# Altium project brushless_no_sensor.PrjPCB
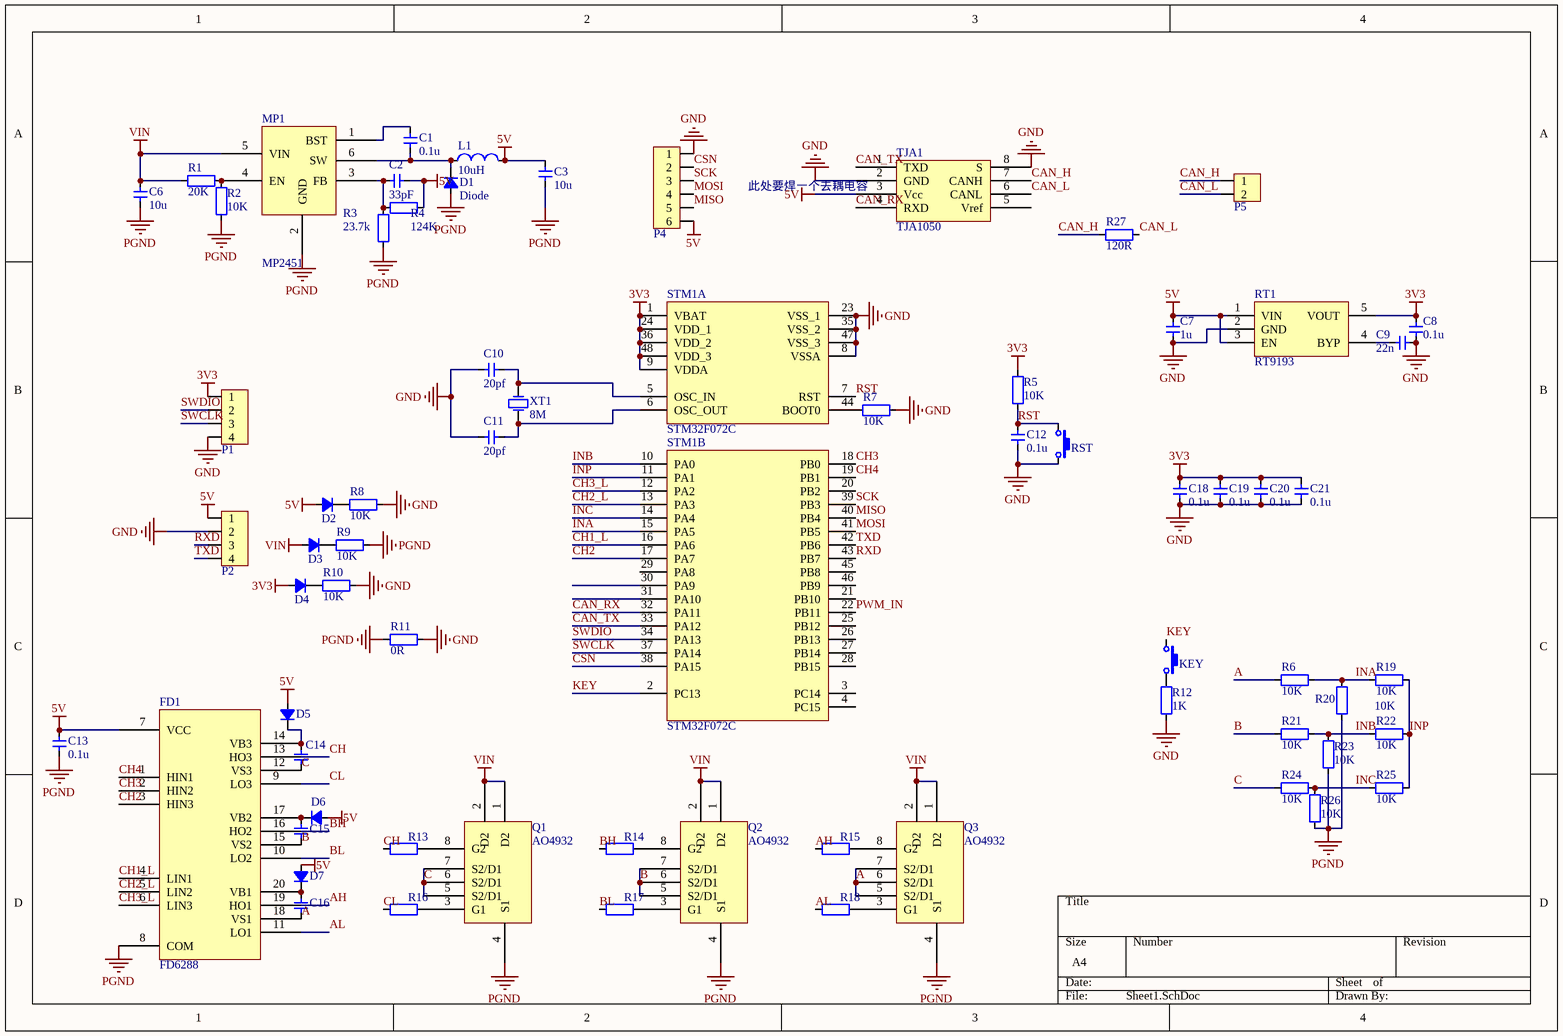
[diagram p0: Sheet1.SchDoc]
1 sheet, 68 parts. Net scope: global (net labels, ports and power ports of the same name join across sheets).
Board file: brushless_nosensor.PcbDoc

## Sheet Sheet1.SchDoc
size A4

### Parts
C1  value 0.1u  [CAP_0603]  (hidden comment: Cap_0603)
C2  value 33pF  [CAP_0603]  (hidden comment: Cap_0603)
C3  value 10u  [CAP_0805]  (hidden comment: Cap_0805)
C6  value 10u  [CAP_0805]  (hidden comment: Cap_0805)
C7  value 1u  [CAP_0603]  (hidden comment: Cap_0603)
C8  value 0.1u  [CAP_0603]  (hidden comment: Cap_0603)
C9  value 22n  [CAP_0603]  (hidden comment: Cap_0603)
C10  value 20pf  [CAP_0603]  (hidden comment: Cap_0603)
C11  value 20pf  [CAP_0603]  (hidden comment: Cap_0603)
C12  value 0.1u  [CAP_0603]  (hidden comment: Cap_0603)
C13  value 0.1u  [CAP_0603]  (hidden comment: Cap_0603)
C14  Cap_0603  [CAP_0603]  (value not drawn)
C15  Cap_0603  [CAP_0603]  (value not drawn)
C16  Cap_0603  [CAP_0603]  (value not drawn)
C18  value 0.1u  [CAP_0603]  (hidden comment: Cap_0603)
C19  value 0.1u  [CAP_0603]  (hidden comment: Cap_0603)
C20  value 0.1u  [CAP_0603]  (hidden comment: Cap_0603)
C21  value 0.1u  [CAP_0603]  (hidden comment: Cap_0603)
D1  Diode  [LED_0805_RED]
D2  D_0805  [LED_0805_YELLOW]  (value not drawn)
D3  D_0805  [LED_0805_YELLOW]  (value not drawn)
D4  D_0805  [LED_0805_YELLOW]  (value not drawn)
D5  D_0805  [LED_0805_YELLOW]  (value not drawn)
D6  D_0805  [LED_0805_YELLOW]  (value not drawn)
D7  D_0805  [LED_0805_YELLOW]  (value not drawn)
FD1  FD6288  [TSSOP_E170_P0.65_20]
KEY  ButtonTACT_3x4x2_180  [ButtonTACT_3x4x2_180H]  (value not drawn)
L1  value 10uH  [IND_CD52]  (hidden comment: Ind_CD32)
MP1  MP2451  [SOT23-6]
P1  HDR1x4_2.54  [HDR1x4_2.54_180]  (value not drawn)
P2  HDR1x4_2.54  [HDR1x4_2.54_180]  (value not drawn)
P4  HDR1x6_2.54  [1.25mm_1X6_SMT]  (value not drawn)
P5  HDR1x2_2.54  [HDR1X2_2.54_180]  (value not drawn)
Q1  AO4932  [SOP_E150_8]
Q2  AO4932  [SOP_E150_8]
Q3  AO4932  [SOP_E150_8]
R1  value 20K  [RES_0603]  (hidden comment: Res_0603)
R2  value 10K  [RES_0603]  (hidden comment: Res_0603)
R3  value 23.7k  [RES_0603]  (hidden comment: Res_0603)
R4  value 124K  [RES_0603]  (hidden comment: Res_0603)
R5  value 10K  [RES_0603]  (hidden comment: Res_0603)
R6  value 10K  [RES_0603]  (hidden comment: Res_0603)
R7  value 10K  [RES_0603]  (hidden comment: Res_0603)
R8  value 10K  [RES_0603]  (hidden comment: Res_0603)
R9  value 10K  [RES_0603]  (hidden comment: Res_0603)
R10  value 10K  [RES_0603]  (hidden comment: Res_0603)
R11  value 0R  [RES_0603]  (hidden comment: Res_0603)
R12  value 1K  [RES_0603]  (hidden comment: Res_0603)
R13  Res_0603  [RES_0603]  (value not drawn)
R14  Res_0603  [RES_0603]  (value not drawn)
R15  Res_0603  [RES_0603]  (value not drawn)
R16  Res_0603  [RES_0603]  (value not drawn)
R17  Res_0603  [RES_0603]  (value not drawn)
R18  Res_0603  [RES_0603]  (value not drawn)
R19  value 10K  [RES_0603]  (hidden comment: Res_0603)
R20  value 10K  [RES_0603]  (hidden comment: Res_0603)
R21  value 10K  [RES_0603]  (hidden comment: Res_0603)
R22  value 10K  [RES_0603]  (hidden comment: Res_0603)
R23  value 10K  [RES_0603]  (hidden comment: Res_0603)
R24  value 10K  [RES_0603]  (hidden comment: Res_0603)
R25  value 10K  [RES_0603]  (hidden comment: Res_0603)
R26  value 10K  [RES_0603]  (hidden comment: Res_0603)
R27  value 120R  [RES_0603]  (hidden comment: Res_0603)
RST  ButtonTACT_3x4x2_180  [ButtonTACT_3x4x2_180H]  (value not drawn)
RT1  RT9193  [SOT23-5]
STM1  STM32F072C  [LQFP_P0.5_48]  (parts A,B of 2)
TJA1  TJA1050  [SOP_E150_8]
XT1  value 8M  [XT_5032_2]  (hidden comment: XTAL_5032_2P)

### Nets
3V3: C8.2 C18.2 C19.2 C20.2 C21.2 D4.1(A) P1.1 R5.2 RT1.5(VOUT) STM1.1(VBAT) STM1.9(VDDA) STM1.24(VDD_1) STM1.36(VDD_2) STM1.48(VDD_3)
5V: C2.1 C3.2 C7.2 C13.2 D2.1(A) D5.1(A) D6.1(A) D7.1(A) FD1.7(VCC) L1.2 P2.1 P4.6 R4.2 RT1.1(VIN) RT1.3(EN) TJA1.3(Vcc)
GND: C7.1 C8.1 C9.1 C10.1 C11.1 C12.1 C18.1 C19.1 C20.1 C21.1 P1.4 P2.2 P4.1 R7.1 R8.2 R10.2 R11.2 R12.1 RST.2 RT1.2(GND) STM1.8(VSSA) STM1.23(VSS_1) STM1.35(VSS_2) STM1.47(VSS_3) TJA1.2(GND) TJA1.8(S)
PGND: C3.1 C6.1 C13.1 D1.1(A) FD1.8(COM) MP1.2(GND) Q1.4(S1) Q2.4(S1) Q3.4(S1) R2.2 R3.2 R9.2 R11.1 R20.1 R23.1 R26.1
VIN: C6.2 D3.1(A) MP1.5(VIN) Q1.1(D2) Q1.2(D2) Q2.1(D2) Q2.2(D2) Q3.1(D2) Q3.2(D2) R1.1
A: C16.2 FD1.18(VS1) Q3.5(S2/D1) Q3.6(S2/D1) Q3.7(S2/D1) R6.1
AH: FD1.19(HO1) R15.1
AL: FD1.11(LO1) R18.1
B: C15.2 FD1.15(VS2) Q2.5(S2/D1) Q2.6(S2/D1) Q2.7(S2/D1) R21.1
BH: FD1.16(HO2) R14.1
BL: FD1.10(LO2) R17.1
C: C14.2 FD1.12(VS3) Q1.5(S2/D1) Q1.6(S2/D1) Q1.7(S2/D1) R24.1
CAN_H: P5.1 R27.2 TJA1.7(CANH)
CAN_L: P5.2 R27.1 TJA1.6(CANL)
CAN_RX: STM1.32(PA11) TJA1.4(RXD)
CAN_TX: STM1.33(PA12) TJA1.1(TXD)
CH: FD1.13(HO3) R13.1
CH1_L: FD1.4(LIN1) STM1.16(PA6)
CH2: FD1.3(HIN3) STM1.17(PA7)
CH2_L: FD1.5(LIN2) STM1.13(PA3)
CH3: FD1.2(HIN2) STM1.18(PB0)
CH3_L: FD1.6(LIN3) STM1.12(PA2)
CH4: FD1.1(HIN1) STM1.19(PB1)
CL: FD1.9(LO3) R16.1
CSN: P4.2 STM1.38(PA15)
INA: R6.2 R19.1 R20.2 STM1.15(PA5)
INB: R21.2 R22.1 R23.2 STM1.10(PA0)
INC: R24.2 R25.1 R26.2 STM1.14(PA4)
INP: R19.2 R22.2 R25.2 STM1.11(PA1)
KEY: KEY.1 STM1.2(PC13)
MISO: P4.5 STM1.40(PB4)
MOSI: P4.4 STM1.41(PB5)
PWM_IN: STM1.22(PB11)
RST: C12.2 R5.1 RST.1 STM1.7(RST)
RXD: P2.3 STM1.43(PB7)
SCK: P4.3 STM1.39(PB3)
SWCLK: P1.3 STM1.37(PA14)
SWDIO: P1.2 STM1.34(PA13)
TXD: P2.4 STM1.42(PB6)
NetC1_1: C1.1 D1.2(K) L1.1 MP1.6(SW)
NetC1_2: C1.2 MP1.1(BST)
NetC2_2: C2.2 MP1.3(FB) R3.1 R4.1
NetC9_2: C9.2 RT1.4(BYP)
NetC10_2: C10.2 STM1.5(OSC_IN) XT1.2(OSC2)
NetC11_2: C11.2 STM1.6(OSC_OUT) XT1.1(OSC1)
NetC14_1: C14.1 D5.2(K) FD1.14(VB3)
NetC15_1: C15.1 D6.2(K) FD1.17(VB2)
NetC16_1: C16.1 D7.2(K) FD1.20(VB1)
NetD2_2: D2.2(K) R8.1
NetD3_2: D3.2(K) R9.1
NetD4_2: D4.2(K) R10.1
NetKEY_2: KEY.2 R12.2
NetMP1_4: MP1.4(EN) R1.2 R2.1
NetQ1_3: Q1.3(G1) R16.2
NetQ1_8: Q1.8(G2) R13.2
NetQ2_3: Q2.3(G1) R17.2
NetQ2_8: Q2.8(G2) R14.2
NetQ3_3: Q3.3(G1) R18.2
NetQ3_8: Q3.8(G2) R15.2
NetR7_2: R7.2 STM1.44(BOOT0)

Not connected (* = marked no-connect by the designer): STM1 3(PC14) 4(PC15) 20(PB2) 21(PB10) 25(PB12) 26(PB13) 27(PB14) 28(PB15) 29(PA8) 30(PA9) 31(PA10) 45(PB8) 46(PB9); TJA1 5(Vref)

### Notes on the sheet
- 此处要焊一个去耦电容

### Library data of the parts
C1 C2 C7-C13 C18-C21 = Cap_0603: Capacitor
C3 C6 = Cap_0805: Capacitor
C14-C16 = Cap_0603: Capacitor; Value: 0.1u
KEY RST = ButtonTACT_3x4x2_180: Button
L1 = Ind_CD32: Inductor
P1 P2 = HDR1x4_2.54: Header
P4 = HDR1x6_2.54T: Header
P5 = HDR1x2_2.54: Header
R1-R12 R19-R27 = Res_0603: Resistor
R13-R18 = Res_0603: Resistor; Value: 10R
RT1 = RT9193: Power
STM1 = STM32F103C: MCU
XT1 = XTAL_5032_2P: Crystal Oscillator